# EAGLE schematic SmoothieBrainz - next round 20160618 (EAGLE 7.2.0)
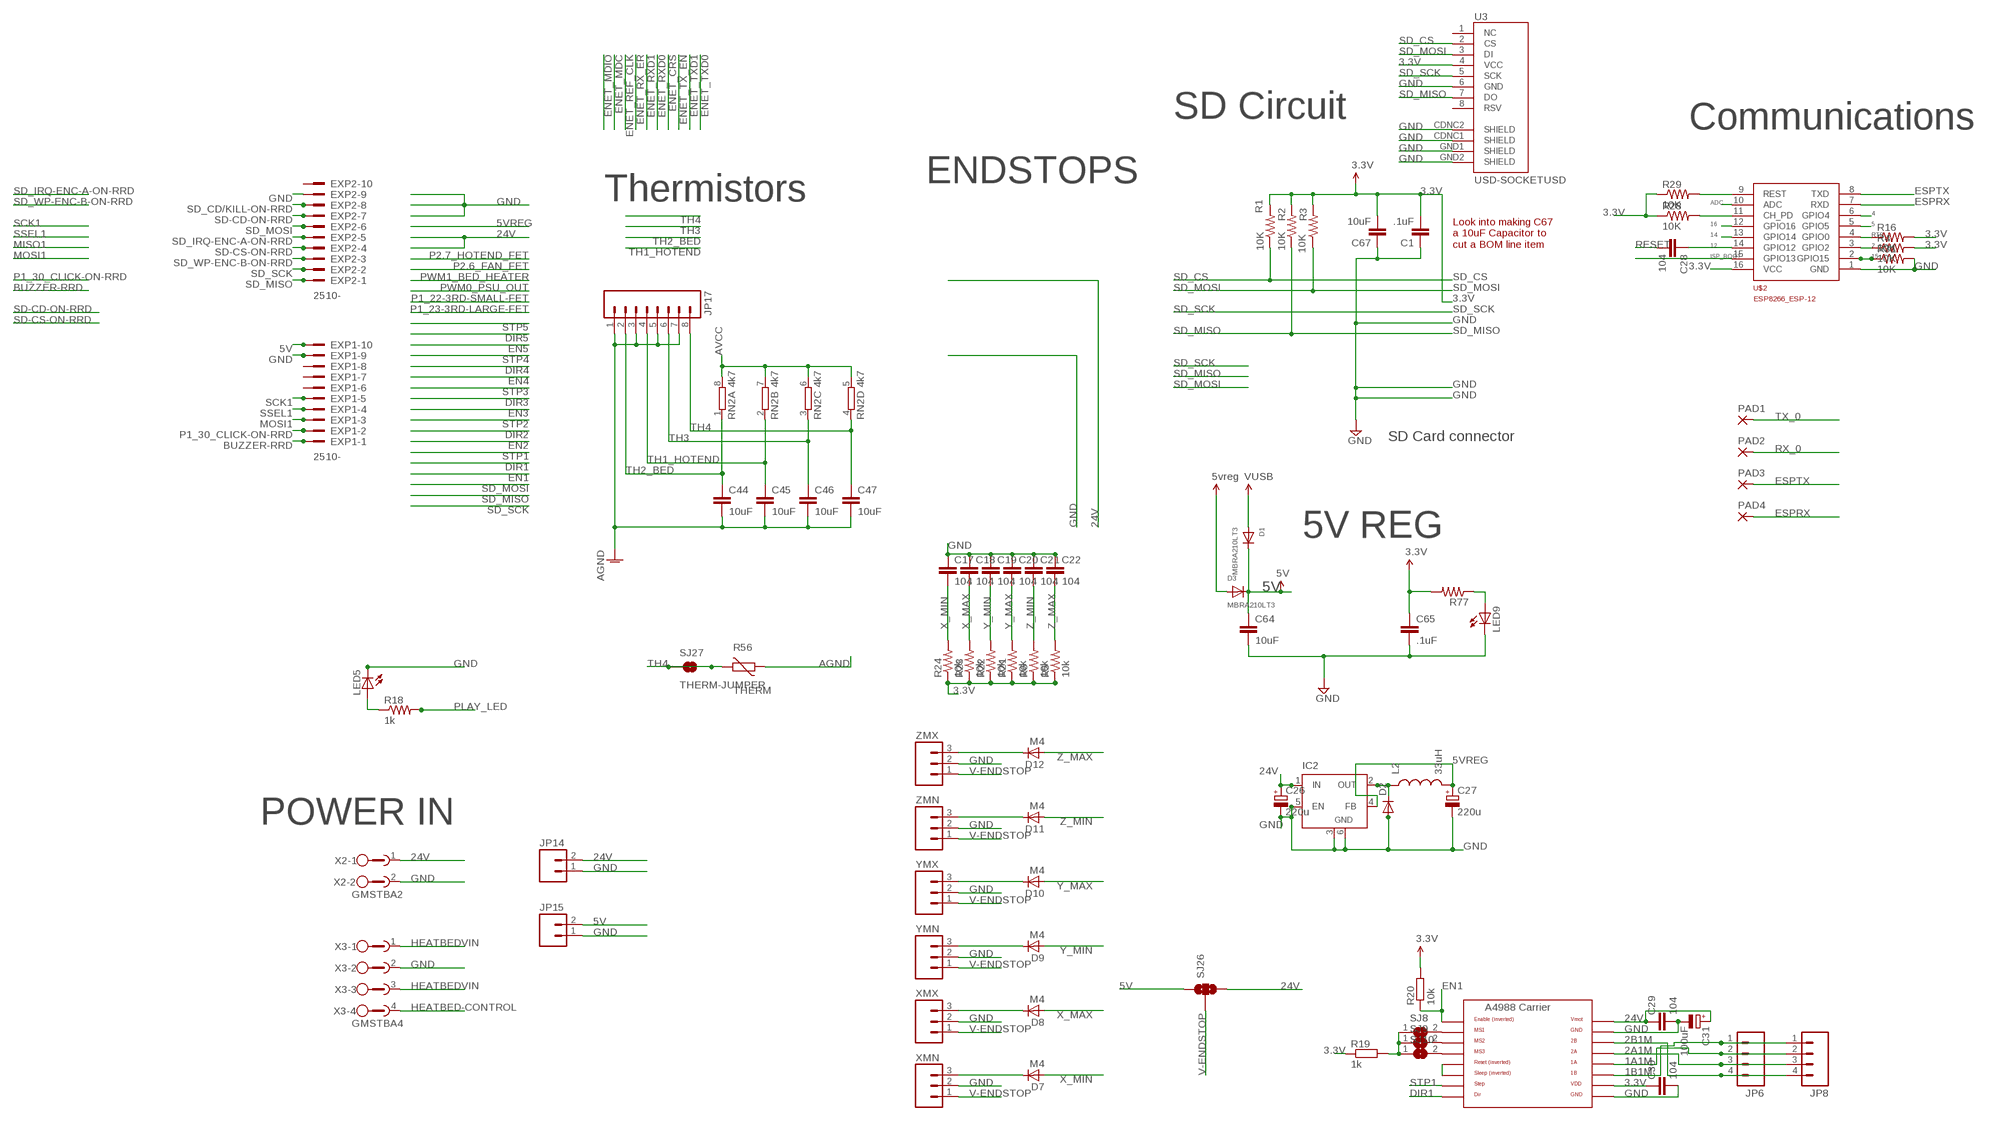
[diagram p0: schematic, sheet 1, part 1 of 3]
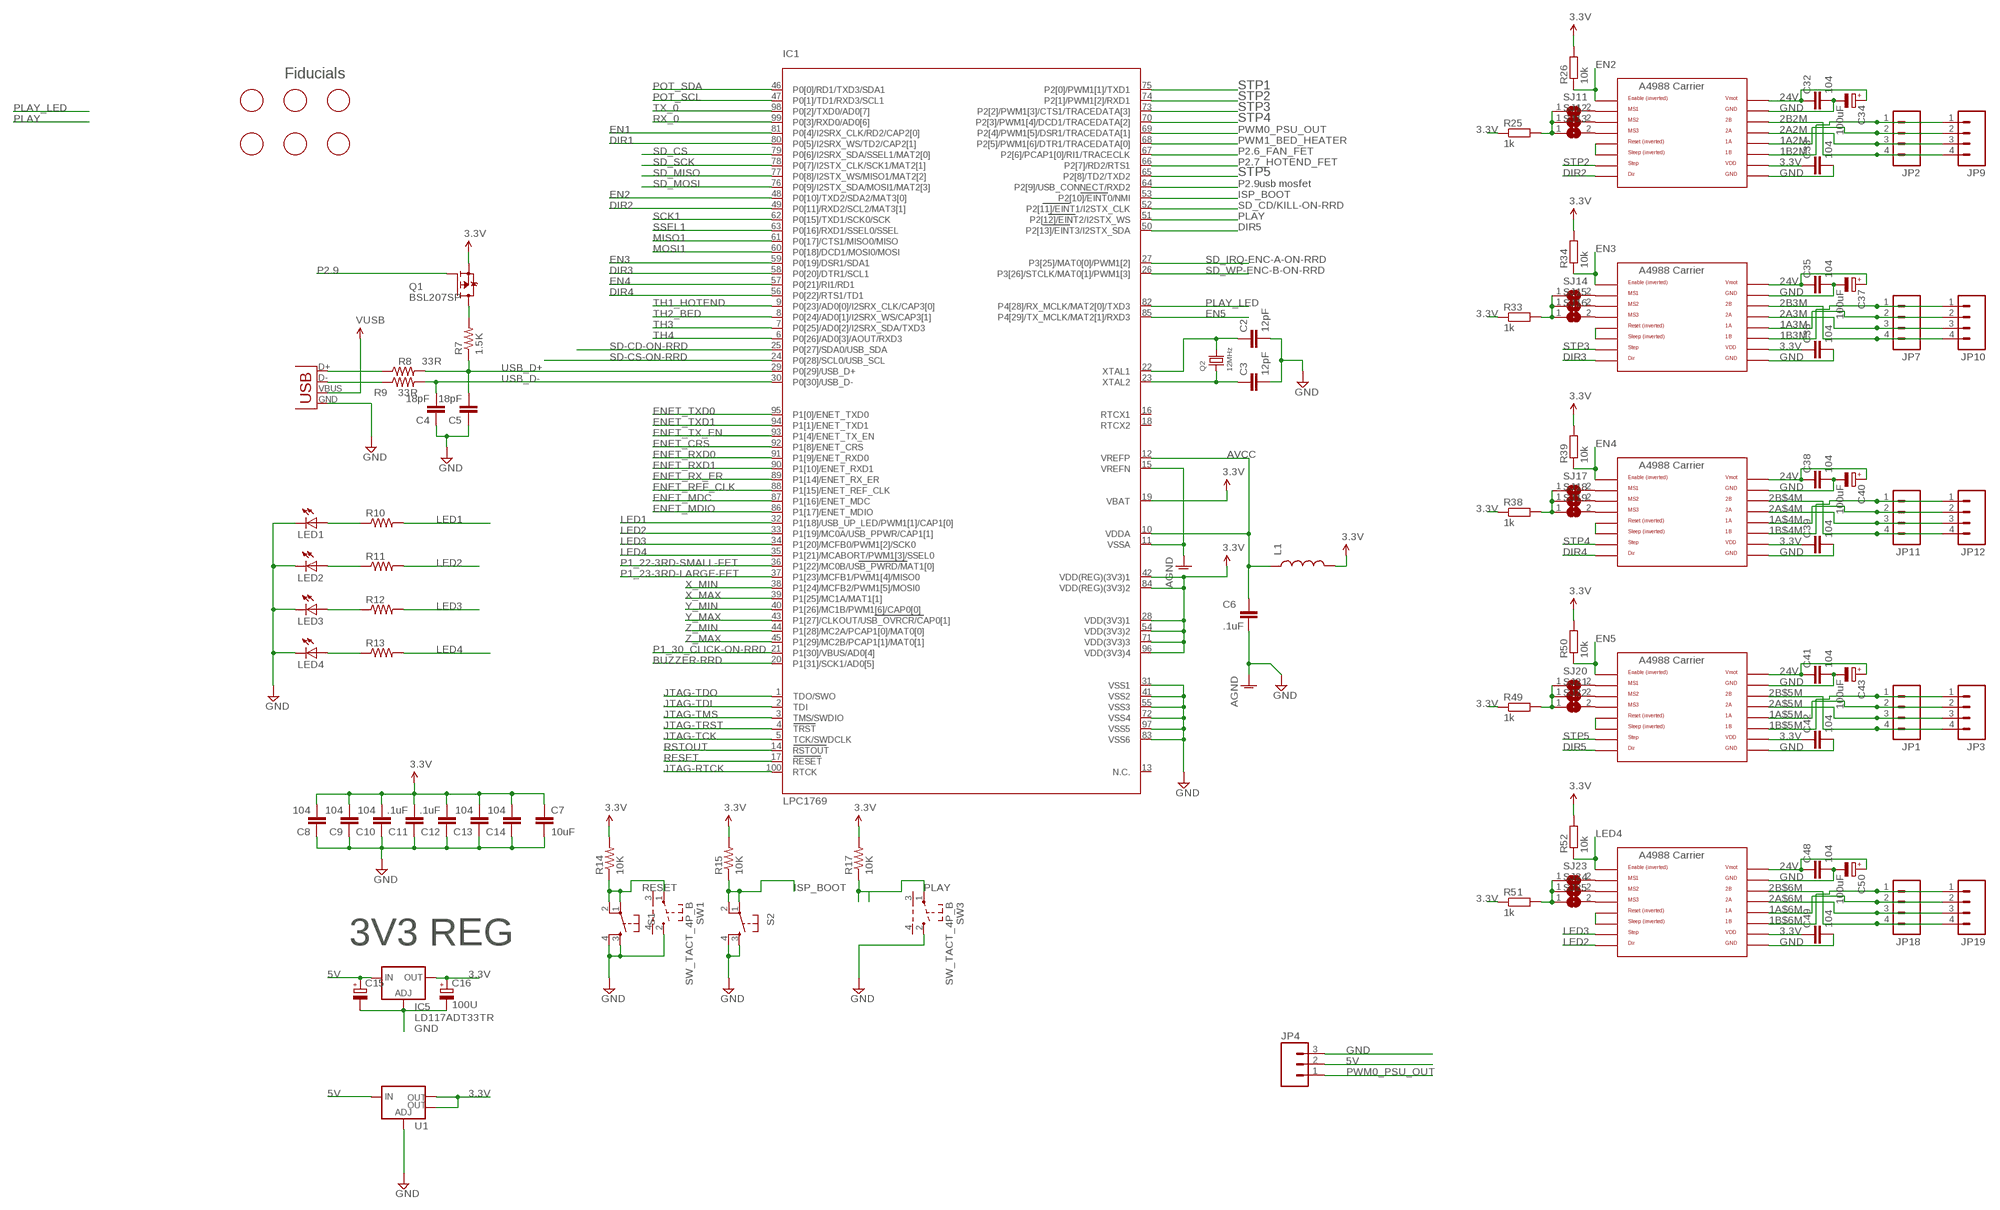
[diagram p1: schematic, sheet 1, part 2 of 3]
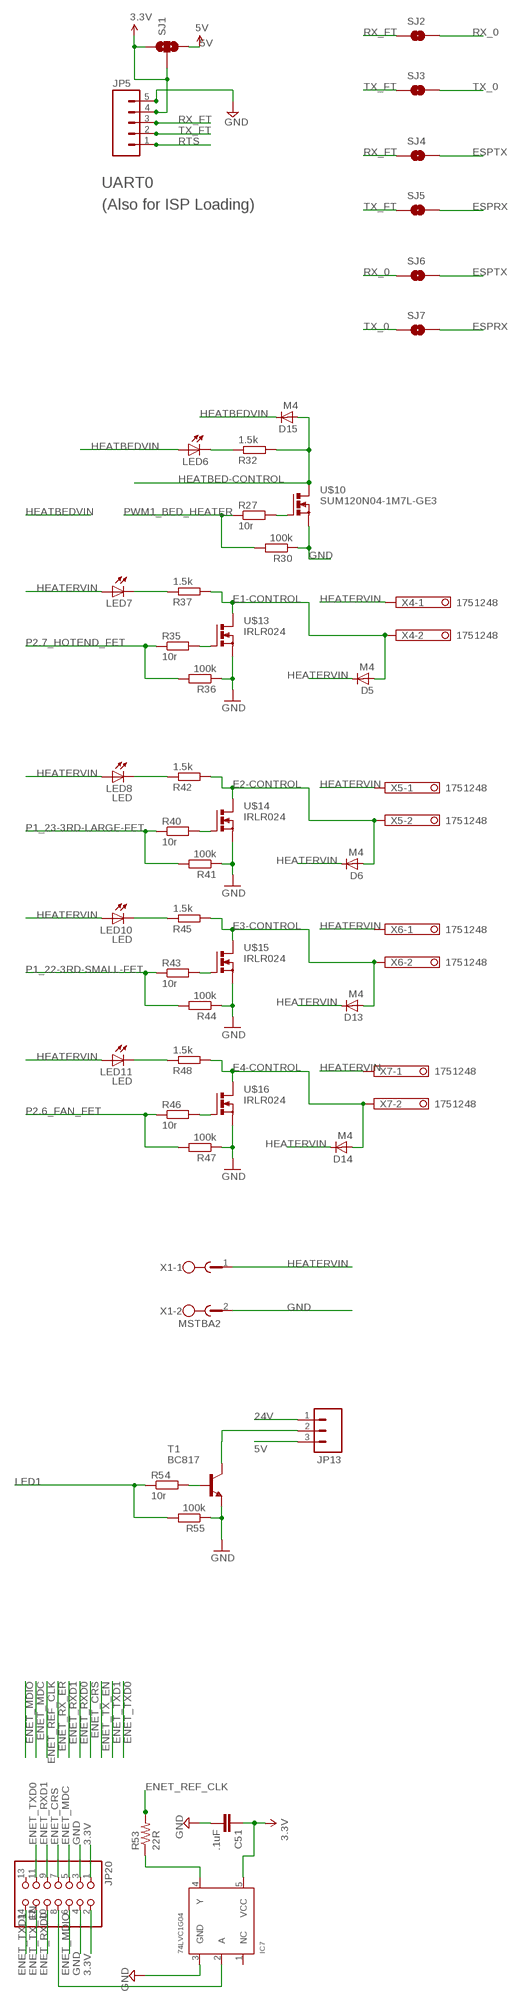
[diagram p2: schematic, sheet 1, part 3 of 3]

## Parts
C1  .1uF  C-EUC0603  [C0603]
C2  12pF  C-EUC0603  [C0603]
C3  12pF  C-EUC0603  [C0603]
C4  18pF  C-EUC0603  [C0603]
C5  18pF  C-EUC0603  [C0603]
C6  .1uF  C-EUC0603  [C0603]
C7  10uF  C-EUC0603  [C0603]
C8  104  C-EUC0603  [C0603]
C9  104  C-EUC0603  [C0603]
C10  104  C-EUC0603  [C0603]
C11  .1uF  C-EUC0603  [C0603]
C12  .1uF  C-EUC0603  [C0603]
C13  104  C-EUC0603  [C0603]
C14  104  C-EUC0603  [C0603]
C15  CPOL-EUE2.5-7  [E2,5-7]
C16  100U  CPOL-EUE2.5-7  [E2,5-7]
C17  104  C-EUC0603  [C0603]
C18  104  C-EUC0603  [C0603]
C19  104  C-EUC0603  [C0603]
C20  104  C-EUC0603  [C0603]
C21  104  C-EUC0603  [C0603]
C22  104  C-EUC0603  [C0603]
C26  220u  CPOL-EUE2.5-7  [E2,5-7]
C27  220u  CPOL-EUE2.5-7  [E2,5-7]
C28  104  C-EUC0603  [C0603]
C29  104  C-EUC0603  [C0603]
C30  104  C-EUC0603  [C0603]
C31  100uF  CPOL-EU153CLV-0605  [153CLV-0605]
C32  104  C-EUC0603  [C0603]
C33  104  C-EUC0603  [C0603]
C34  100uF  CPOL-EU153CLV-0605  [153CLV-0605]
C35  104  C-EUC0603  [C0603]
C36  104  C-EUC0603  [C0603]
C37  100uF  CPOL-EU153CLV-0605  [153CLV-0605]
C38  104  C-EUC0603  [C0603]
C39  104  C-EUC0603  [C0603]
C40  100uF  CPOL-EU153CLV-0605  [153CLV-0605]
C41  104  C-EUC0603  [C0603]
C42  104  C-EUC0603  [C0603]
C43  100uF  CPOL-EU153CLV-0605  [153CLV-0605]
C44  10uF  C-EUC0603  [C0603]
C45  10uF  C-EUC0603  [C0603]
C46  10uF  C-EUC0603  [C0603]
C47  10uF  C-EUC0603  [C0603]
C48  104  C-EUC0603  [C0603]
C49  104  C-EUC0603  [C0603]
C50  100uF  CPOL-EU153CLV-0605  [153CLV-0605]
C51  .1uF  C-EUC0603  [C0603]
C64  10uF  C-EUC0603  [C0603]
C65  .1uF  C-EUC0603  [C0603]
C67  10uF  C-EUC0603  [C0603]
D1  MBRA210LT3  DIODESMA  [SMADIODE]
D2  DIODE-DO-214AC  [DO-214AC]
D3  MBRA210LT3  DIODESMA  [SMADIODE]
D5  M4  D-SOD-87  [SOD87]
D6  M4  D-SOD-87  [SOD87]
D7  M4  D-SOD-87  [SOD87]
D8  M4  D-SOD-87  [SOD87]
D9  M4  D-SOD-87  [SOD87]
D10  M4  D-SOD-87  [SOD87]
D11  M4  D-SOD-87  [SOD87]
D12  M4  D-SOD-87  [SOD87]
D13  M4  D-SOD-87  [SOD87]
D14  M4  D-SOD-87  [SOD87]
D15  M4  D-SOD-87  [SOD87]
EXP1  2510-  [PAK100/2500-10]
EXP2  2510-  [PAK100/2500-10]
IC1  LPC1769  LPC1768  [LQFP100]
IC2  LM2596S  [TO263-5]
IC5  LD117ADT33TR  [DPACK]
IC7  74LVC1G04  [SOT23-5]
JP1  M04POLAR_LOCK  [MOLEX-1X4_LOCK]
JP2  M04POLAR_LOCK  [MOLEX-1X4_LOCK]
JP3  M04LOCK  [1X04_LOCK]
JP4  M03LOCK  [1X03_LOCK]
JP5  M05NO_SILK  [1X05_NO_SILK]
JP6  M04POLAR_LOCK  [MOLEX-1X4_LOCK]
JP7  M04POLAR_LOCK  [MOLEX-1X4_LOCK]
JP8  M04LOCK  [1X04_LOCK]
JP9  M04LOCK  [1X04_LOCK]
JP10  M04LOCK  [1X04_LOCK]
JP11  M04POLAR_LOCK  [MOLEX-1X4_LOCK]
JP12  M04LOCK  [1X04_LOCK]
JP13  M03LOCK  [1X03_LOCK]
JP14  M02LOCK  [1X02_LOCK]
JP15  M02LOCK  [1X02_LOCK]
JP17  M08LOCK  [1X08_LOCK]
JP18  M04POLAR_LOCK  [MOLEX-1X4_LOCK]
JP19  M04LOCK  [1X04_LOCK]
JP20  PINHD-2X7  [2X07]
L1  INDUCTOR0603  [0603]
L2  33uH  INDUCTORPWR  [CDRH125]
LED1  LEDCHIP-LED0805  [CHIP-LED0805]
LED2  LEDCHIP-LED0805  [CHIP-LED0805]
LED3  LEDCHIP-LED0805  [CHIP-LED0805]
LED4  LEDCHIP-LED0805  [CHIP-LED0805]
LED5  LEDCHIP-LED0603  [CHIP-LED0603]
LED6  LEDSML0603  [SML0603]
LED7  LEDSML0603  [SML0603]
LED8  LED  LEDSML0603  [SML0603]
LED9  LEDCHIP-LED0805  [CHIP-LED0805]
LED10  LED  LEDSML0603  [SML0603]
LED11  LED  LEDSML0603  [SML0603]
PAD1  1,6/0,9  [1,6/0,9]
PAD2  1,6/0,9  [1,6/0,9]
PAD3  1,6/0,9  [1,6/0,9]
PAD4  1,6/0,9  [1,6/0,9]
Q1  BSL207SP  [SC74_INFINEON]
Q2  12MHz  CRYSTALTHIN  [CRYSTAL_3.2X2.5]
R1  10K  R-US_R0603  [R0603]
R2  10K  R-US_R0603  [R0603]
R3  10K  R-US_R0603  [R0603]
R4  10K  R-US_R0603  [R0603]
R5  10k  R-US_R0603  [R0603]
R6  10k  R-US_R0603  [R0603]
R7  1.5K  R-US_R0603  [R0603]
R8  33R  R-US_R0603  [R0603]
R9  33R  R-US_R0603  [R0603]
R10  R-US_R0603  [R0603]
R11  R-US_R0603  [R0603]
R12  R-US_R0603  [R0603]
R13  R-US_R0603  [R0603]
R14  10K  R-US_R0603  [R0603]
R15  10K  R-US_R0603  [R0603]
R16  10K  R-US_R0603  [R0603]
R17  10K  R-US_R0603  [R0603]
R18  1k  R-US_R0603  [R0603]
R19  1k  R-EU_R0603  [R0603]
R20  10k  R-EU_R0603  [R0603]
R21  10k  R-US_R0603  [R0603]
R22  10k  R-US_R0603  [R0603]
R23  10k  R-US_R0603  [R0603]
R24  10k  R-US_R0603  [R0603]
R25  1k  R-EU_R0603  [R0603]
R26  10k  R-EU_R0603  [R0603]
R27  10r  R-EU_R0603  [R0603]
R28  10K  R-US_R0603  [R0603]
R29  10K  R-US_R0603  [R0603]
R30  100k  R-EU_R0603  [R0603]
R31  10K  R-US_R0603  [R0603]
R32  1.5k  R-EU_R0603  [R0603]
R33  1k  R-EU_R0603  [R0603]
R34  10k  R-EU_R0603  [R0603]
R35  10r  R-EU_R0603  [R0603]
R36  100k  R-EU_R0603  [R0603]
R37  1.5k  R-EU_R0603  [R0603]
R38  1k  R-EU_R0603  [R0603]
R39  10k  R-EU_R0603  [R0603]
R40  10r  R-EU_R0603  [R0603]
R41  100k  R-EU_R0603  [R0603]
R42  1.5k  R-EU_R0603  [R0603]
R43  10r  R-EU_R0603  [R0603]
R44  100k  R-EU_R0603  [R0603]
R45  1.5k  R-EU_R0603  [R0603]
R46  10r  R-EU_R0603  [R0603]
R47  100k  R-EU_R0603  [R0603]
R48  1.5k  R-EU_R0603  [R0603]
R49  1k  R-EU_R0603  [R0603]
R50  10k  R-EU_R0603  [R0603]
R51  1k  R-EU_R0603  [R0603]
R52  10k  R-EU_R0603  [R0603]
R53  22R  R-US_R0603  [R0603]
R54  10r  R-EU_R0603  [R0603]
R55  100k  R-EU_R0603  [R0603]
R56  THERM  VARISTORCN0603  [CT/CN0603]
R77  R-US_R0603  [R0603]
RN2  4k7  4R-N0603-ARV  [0603-ARV]
S1  TAC_SWITCHSMD  [TACTILE_SWITCH_SMD]
S2  TAC_SWITCHSMD  [TACTILE_SWITCH_SMD]
SJ1  SOLDERJUMPER_2WAYS  [SJ_3]
SJ2  SOLDERJUMPERNC  [SJ_2S]
SJ3  SOLDERJUMPERNC  [SJ_2S]
SJ4  SOLDERJUMPERNC  [SJ_2S]
SJ5  SOLDERJUMPERNC  [SJ_2S]
SJ6  SOLDERJUMPERNC  [SJ_2S]
SJ7  SOLDERJUMPERNC  [SJ_2S]
SJ8  SJ  [SJ]
SJ9  SJ  [SJ]
SJ10  SJ  [SJ]
SJ11  SJ  [SJ]
SJ12  SJ  [SJ]
SJ13  SJ  [SJ]
SJ14  SJ  [SJ]
SJ15  SJ  [SJ]
SJ16  SJ  [SJ]
SJ17  SJ  [SJ]
SJ18  SJ  [SJ]
SJ19  SJ  [SJ]
SJ20  SJ  [SJ]
SJ21  SJ  [SJ]
SJ22  SJ  [SJ]
SJ23  SJ  [SJ]
SJ24  SJ  [SJ]
SJ25  SJ  [SJ]
SJ26  SOLDERJUMPER_2WAYS  [SJ_3]
SJ27  THERM-JUMPER  SOLDERJUMPERTRACE  [SJ_2S-TRACE]
SW1  SW_TACT_4P_B  [SW_TACT_STANDARD_RIGHT_ANGLE]
SW3  SW_TACT_4P_B  [SW_TACT_STANDARD_RIGHT_ANGLE]
T1  BC817  BC817-40-NPN-SOT23-BEC  [SOT23-BEC]
U1  V_REG_LM1117SOT223  [SOT223]
U3  USD-SOCKETUSD  [USD-SOCKET-PP]
U$1  POLOLU_A4983CARRIER  [A4988BREAKOUT]
U$2  ESP8266_ESP-12  [ESP8266-ESP12]
U$5  POLOLU_A4983CARRIER  [A4988BREAKOUT]
U$6  POLOLU_A4983CARRIER  [A4988BREAKOUT]
U$7  POLOLU_A4983CARRIER  [A4988BREAKOUT]
U$8  POLOLU_A4983CARRIER  [A4988BREAKOUT]
U$9  POLOLU_A4983CARRIER  [A4988BREAKOUT]
U$10  SUM120N04-1M7L-GE3  N-POWER-MOSFETD2PAK-MOSFET  [D2PACK]
U$11  FIDUCIAL  [FIDUCIAL_1MM]
U$12  FIDUCIAL  [FIDUCIAL_1MM]
U$13  IRLR024  N-POWER-MOSFETDPAK-MOSFET  [D-PAK_TO252AA]
U$14  IRLR024  N-POWER-MOSFETDPAK-MOSFET  [D-PAK_TO252AA]
U$15  IRLR024  N-POWER-MOSFETDPAK-MOSFET  [D-PAK_TO252AA]
U$16  IRLR024  N-POWER-MOSFETDPAK-MOSFET  [D-PAK_TO252AA]
U$17  FIDUCIAL  [FIDUCIAL_1MM]
U$18  FIDUCIAL  [FIDUCIAL_1MM]
U$19  FIDUCIAL  [FIDUCIAL_1MM]
U$20  FIDUCIAL  [FIDUCIAL_1MM]
X1  MSTBA2  [MSTBA2]
X2  GMSTBA2  [GMSTBA2]
X3  GMSTBA4  [GMSTBA4]
X4  1751248  [1751248]
X5  1751248  [1751248]
X6  1751248  [1751248]
X7  1751248  [1751248]
X14  USBPTH  [USB-B-PTH]
XMN  M03POLAR_LOCK  [MOLEX-1X3_LOCK]
XMX  M03POLAR_LOCK  [MOLEX-1X3_LOCK]
YMN  M03POLAR_LOCK  [MOLEX-1X3_LOCK]
YMX  M03POLAR_LOCK  [MOLEX-1X3_LOCK]
ZMN  M03POLAR_LOCK  [MOLEX-1X3_LOCK]
ZMX  M03POLAR_LOCK  [MOLEX-1X3_LOCK]

## Nets
1A1M: JP6.2 JP8.2 U$1.1A
1A2M: JP2.2 JP9.2 U$5.1A
1A3M: JP7.2 JP10.2 U$6.1A
1A$4M: JP11.2 JP12.2 U$7.1A
1A$5M: JP1.2 JP3.2 U$8.1A
1A$6M: JP18.2 JP19.2 U$9.1A
1B1M: JP6.1 JP8.1 U$1.1B
1B2M: JP2.1 JP9.1 U$5.1B
1B3M: JP7.1 JP10.1 U$6.1B
1B$4M: JP11.1 JP12.1 U$7.1B
1B$5M: JP1.1 JP3.1 U$8.1B
1B$6M: JP18.1 JP19.1 U$9.1B
2: R4.1 U$2.3(GPIO2)
2A1M: JP6.3 JP8.3 U$1.2A
2A2M: JP2.3 JP9.3 U$5.2A
2A3M: JP7.3 JP10.3 U$6.2A
2A$4M: JP11.3 JP12.3 U$7.2A
2A$5M: JP1.3 JP3.3 U$8.2A
2A$6M: JP18.3 JP19.3 U$9.2A
2B1M: JP6.4 JP8.4 U$1.2B
2B2M: JP2.4 JP9.4 U$5.2B
2B3M: JP7.4 JP10.4 U$6.2B
2B$4M: JP11.4 JP12.4 U$7.2B
2B$5M: JP1.4 JP3.4 U$8.2B
2B$6M: JP18.4 JP19.4 U$9.2B
3.3V: C1.2 C7.1 C8.2 C9.2 C10.2 C11.2 C12.2 C13.2 C14.2 C16.+ C30.1 C33.1 C36.1 C39.1 C42.1 C49.1 C51.1 C65.1 C67.2 IC1.19(VBAT) IC1.28(VDD(3V3)1) IC1.42(VDD(REG)(3V3)1) IC1.54(VDD(3V3)2) IC1.71(VDD(3V3)3) IC1.84(VDD(REG)(3V3)2) IC1.96(VDD(3V3)4) IC5.4(OUT) IC7.5(VCC) JP5.4 JP20.1 JP20.2 L1.2 Q1.4(S) R1.2 R2.2 R3.2 R4.2 R5.1 R6.1 R14.2 R15.2 R16.2 R17.2 R19.1 R20.2 R21.1 R22.1 R23.1 R24.1 R25.1 R26.2 R28.1 R29.1 R33.1 R34.2 R38.1 R39.2 R49.1 R50.2 R51.1 R52.2 R77.2 SJ1.1 SJ1.2 U1.2(OUT) U1.4(OUT) U3.4(VCC) U$1.VDD U$2.16(VCC) U$5.VDD U$6.VDD U$7.VDD U$8.VDD U$9.VDD
4: U$2.6(GPIO4)
5: U$2.5(GPIO5)
5V: C15.+ C64.1 D1.C D3.C EXP1.10 IC5.3(IN) JP4.2 JP13.3 JP15.2 SJ1.3 SJ26.1 U1.3(IN)
5VREG: C27.+ D3.A IC2.4(FB) L2.2 ; supply symbol labelled 5vreg
12: C28.1 U$2.14(GPIO12)
14: U$2.13(GPIO14)
15: R31.1 U$2.2(GPIO15)
16: U$2.12(GPIO16)
24V: C26.+ C29.1 C31.+ C32.1 C34.+ C35.1 C37.+ C38.1 C40.+ C41.1 C43.+ C48.1 C50.+ IC2.1(IN) JP13.1 JP14.2 SJ26.3 U$1.VMOT U$5.VMOT U$6.VMOT U$7.VMOT U$8.VMOT U$9.VMOT X2.1
ADC: U$2.10(ADC)
AGND: C6.2 C44.2 C45.2 C46.2 C47.2 IC1.11(VSSA) IC1.15(VREFN) JP17.1 JP17.3 JP17.5 JP17.7 R56.1 ; supply symbol labelled GND
AVCC: C6.1 IC1.10(VDDA) IC1.12(VREFP) L1.1 RN2.5 RN2.6 RN2.7 RN2.8
BUZZER-RRD: EXP1.1 IC1.20(P1[31]/SCK1/AD0[5])
DIR1: IC1.80(P0[5]/I2SRX_WS/TD2/CAP2[1]) U$1.DIR
DIR2: IC1.49(P0[11]/RXD2/SCL2/MAT3[1]) U$5.DIR
DIR3: IC1.58(P0[20]/DTR1/SCL1) U$6.DIR
DIR4: IC1.56(P0[22]/RTS1/TD1) U$7.DIR
DIR5: IC1.50(P2[13]/EINT3/I2STX_SDA) U$8.DIR
E1-CONTROL [3.3-Amp Class]: D5.2(A) R37.2 U$13.4(D) X4.2
E2-CONTROL [3.3-Amp Class]: D6.2(A) R42.2 U$14.4(D) X5.2
E3-CONTROL [3.3-Amp Class]: D13.2(A) R45.2 U$15.4(D) X6.2
E4-CONTROL [3.3-Amp Class]: D14.2(A) R48.2 U$16.4(D) X7.2
EN1: IC1.81(P0[4]/I2SRX_CLK/RD2/CAP2[0]) R20.1 U$1.EN
EN2: IC1.48(P0[10]/TXD2/SDA2/MAT3[0]) R26.1 U$5.EN
EN3: IC1.59(P0[19]/DSR1/SDA1) R34.1 U$6.EN
EN4: IC1.57(P0[21]/RI1/RD1) R39.1 U$7.EN
EN5: IC1.85(P4[29]/TX_MCLK/MAT2[1]/RXD3) R50.1 U$8.EN
ENET_CRS: IC1.92(P1[8]/ENET_CRS) JP20.7
ENET_MDC: IC1.87(P1[16]/ENET_MDC) JP20.5
ENET_MDIO: IC1.86(P1[17]/ENET_MDIO) JP20.6
ENET_REF_CLK: IC1.88(P1[15]/ENET_REF_CLK) R53.2
ENET_RX_ER: IC1.89(P1[14]/ENET_RX_ER)
ENET_RXD0: IC1.91(P1[9]/ENET_RXD0) JP20.10
ENET_RXD1: IC1.90(P1[10]/ENET_RXD1) JP20.9
ENET_TX_EN: IC1.93(P1[4]/ENET_TX_EN) JP20.12
ENET_TXD0: IC1.95(P1[0]/ENET_TXD0) JP20.11
ENET_TXD1: IC1.94(P1[1]/ENET_TXD1) JP20.14
ESPRX: PAD4.1(P) SJ5.2 SJ7.2 U$2.7(RXD)
ESPTX: PAD3.1(P) SJ4.2 SJ6.2 U$2.8(TXD)
GND: C1.1 C2.2 C3.2 C4.1 C5.1 C7.2 C8.1 C9.1 C10.1 C11.1 C12.1 C13.1 C14.1 C15.- C16.- C17.1 C18.1 C19.1 C20.1 C21.1 C22.1 C26.- C27.- C29.2 C30.2 C31.- C32.2 C33.2 C34.- C35.2 C36.2 C37.- C38.2 C39.2 C40.- C41.2 C42.2 C43.- C48.2 C49.2 C50.- C51.2 C64.2 C65.2 C67.1 D2.2(A) EXP1.9 EXP2.9 IC1.31(VSS1) IC1.41(VSS2) IC1.55(VSS3) IC1.72(VSS4) IC1.83(VSS6) IC1.97(VSS5) IC2.3(GND) IC2.5(EN) IC2.6(GND) IC5.1(ADJ) IC7.3(GND) JP4.3 JP5.5 JP14.1 JP15.1 JP20.3 JP20.4 LED1.C LED2.C LED3.C LED4.C LED5.C LED9.C R30.1 R31.2 R36.1 R41.1 R44.1 R47.1 R55.1 S1.3 S1.4 S2.3 S2.4 SW1.2 SW3.2 T1.E U1.1(ADJ) U3.6(GND) U3.CDNC1(SHIELD) U3.CDNC2(SHIELD) U3.GND1(SHIELD) U3.GND2(SHIELD) U$1.GND U$1.GND@0(GND) U$2.1(GND) U$5.GND U$5.GND@0(GND) U$6.GND U$6.GND@0(GND) U$7.GND U$7.GND@0(GND) U$8.GND U$8.GND@0(GND) U$9.GND U$9.GND@0(GND) U$10.3(S) U$13.3(S) U$14.3(S) U$15.3(S) U$16.3(S) X1.2 X2.2 X3.2 X14.GND XMN.2 XMX.2 YMN.2 YMX.2 ZMN.2 ZMX.2
HEATBED-CONTROL: D15.2(A) R32.2 U$10.2(D) X3.4
HEATBEDVIN: D15.1(C) LED6.A X3.1 X3.3
HEATERVIN: D5.1(C) D6.1(C) D13.1(C) D14.1(C) LED7.A LED8.A LED10.A LED11.A X1.1 X4.1 X5.1 X6.1 X7.1
ISP_BOOT: IC1.53(P2[10]/EINT0/NMI) R15.1 S2.1 S2.2 U$2.15(GPIO13)
JTAG-RTCK: IC1.100(RTCK)
JTAG-TCK: IC1.5(TCK/SWDCLK)
JTAG-TDI: IC1.2(TDI)
JTAG-TDO: IC1.1(TDO/SWO)
JTAG-TMS: IC1.3(TMS/SWDIO)
JTAG-TRST: IC1.4(TRST)
LED1: IC1.32(P1[18]/USB_UP_LED/PWM1[1]/CAP1[0]) R10.2 R54.1 R55.2
LED2: IC1.33(P1[19]/MC0A/USB_PPWR/CAP1[1]) R11.2 U$9.DIR
LED3: IC1.34(P1[20]/MCFB0/PWM1[2]/SCK0) R12.2 U$9.STEP
LED4: IC1.35(P1[21]/MCABORT/PWM1[3]/SSEL0) R13.2 R52.1 U$9.EN
MISO1: IC1.61(P0[17]/CTS1/MISO0/MISO)
MOSI1: EXP1.3 IC1.60(P0[18]/DCD1/MOSI0/MOSI)
N$1: C2.1 IC1.22(XTAL1) Q2.2
N$2: C3.1 IC1.23(XTAL2) Q2.1
N$3: LED5.A R18.1
N$4: D11.1(C) ZMN.3
N$5: D10.1(C) YMX.3
N$6: SJ8.2 U$1.MS1
N$7: D9.1(C) YMN.3
N$8: SJ9.2 U$1.MS2
N$9: D2.1(C) IC2.2(OUT) L2.1
N$10: SJ10.2 U$1.MS3
N$11: D8.1(C) XMX.3
N$12: U$5.RST U$5.SLP(SLEEP)
N$13: D7.1(C) XMN.3
N$14: R25.2 SJ11.1 SJ12.1 SJ13.1
N$15: SJ11.2 U$5.MS1
N$16: D12.1(C) ZMX.3
N$17: SJ12.2 U$5.MS2
N$18: R28.2 U$2.11(CH_PD)
N$19: SJ13.2 U$5.MS3
N$20: R27.2 U$10.1(G)
N$21: LED6.C R32.1
N$22: U$6.RST U$6.SLP(SLEEP)
N$24: R33.2 SJ14.1 SJ15.1 SJ16.1
N$25: SJ14.2 U$6.MS1
N$26: SJ15.2 U$6.MS2
N$27: SJ16.2 U$6.MS3
N$28: R35.2 U$13.1(G)
N$29: R19.2 SJ8.1 SJ9.1 SJ10.1
N$30: LED7.C R37.1
N$31: U$7.RST U$7.SLP(SLEEP)
N$32: R38.2 SJ17.1 SJ18.1 SJ19.1
N$33: SJ17.2 U$7.MS1
N$34: SJ18.2 U$7.MS2
N$35: U$1.RST U$1.SLP(SLEEP)
N$36: SJ19.2 U$7.MS3
N$37: R40.2 U$14.1(G)
N$38: LED8.C R42.1
N$39: R43.2 U$15.1(G)
N$40: LED10.C R45.1
N$41: R46.2 U$16.1(G)
N$42: LED11.C R48.1
N$43: U$8.RST U$8.SLP(SLEEP)
N$44: R49.2 SJ20.1 SJ21.1 SJ22.1
N$45: SJ20.2 U$8.MS1
N$46: SJ21.2 U$8.MS2
N$47: SJ22.2 U$8.MS3
N$48: U$9.RST U$9.SLP(SLEEP)
N$49: R51.2 SJ23.1 SJ24.1 SJ25.1
N$50: SJ23.2 U$9.MS1
N$51: Q1.1(D) Q1.2(D) Q1.5(D) Q1.6(D) R7.2
N$53: SJ24.2 U$9.MS2
N$54: SJ25.2 U$9.MS3
N$55: R54.2 T1.B
N$56: JP13.2 T1.C
N$61: R8.1 X14.D+
N$62: R9.1 X14.D-
N$77: IC7.2(A) JP20.8
N$78: IC7.4(Y) R53.1
N$80: LED9.A R77.1
N$84: LED4.A R13.1
N$85: LED3.A R12.1
N$86: LED2.A R11.1
N$87: LED1.A R10.1
P1_22-3RD-SMALL-FET: IC1.36(P1[22]/MC0B/USB_PWRD/MAT1[0]) R43.1 R44.2
P1_23-3RD-LARGE-FET: IC1.37(P1[23]/MCFB1/PWM1[4]/MISO0) R40.1 R41.2
P1_30_CLICK-ON-RRD: EXP1.2 IC1.21(P1[30]/VBUS/AD0[4])
P2.6_FAN_FET: IC1.67(P2[6]/PCAP1[0]/RI1/TRACECLK) R46.1 R47.2
P2.7_HOTEND_FET: IC1.66(P2[7]/RD2/RTS1) R35.1 R36.2
P2.9: IC1.64(P2[9]/USB_CONNECT/RXD2) Q1.3(G)
PLAY: IC1.51(P2[12]/EINT2/I2STX_WS) R17.1 SW3.1
PLAY_LED: IC1.82(P4[28]/RX_MCLK/MAT2[0]/TXD3) R18.2
POT_SCL: IC1.47(P0[1]/TD1/RXD3/SCL1)
POT_SDA: IC1.46(P0[0]/RD1/TXD3/SDA1)
PWM0_PSU_OUT: IC1.69(P2[4]/PWM1[5]/DSR1/TRACEDATA[1]) JP4.1
PWM1_BED_HEATER: IC1.68(P2[5]/PWM1[6]/DTR1/TRACEDATA[0]) R27.1 R30.2
RESET: C28.2 IC1.17(RESET) R14.1 S1.1 S1.2 SW1.1
RESET1: R29.2 U$2.9(REST)
RSTOUT: IC1.14(RSTOUT)
RTS: JP5.1 R16.1 U$2.4(GPIO0)
RX_0: IC1.99(P0[3]/RXD0/AD0[6]) PAD2.1(P) SJ2.2 SJ6.1
RX_FT: JP5.3 SJ2.1 SJ4.1
SCK1: EXP1.5 IC1.62(P0[15]/TXD1/SCK0/SCK)
SD-CD-ON-RRD: EXP2.7 IC1.25(P0[27]/SDA0/USB_SDA)
SD-CS-ON-RRD: EXP2.4 IC1.24(P0[28]/SCL0/USB_SCL)
SD_CD/KILL-ON-RRD: EXP2.8 IC1.52(P2[11]/EINT1/I2STX_CLK)
SD_CS: IC1.79(P0[6]/I2SRX_SDA/SSEL1/MAT2[0]) R1.1 U3.2(CS)
SD_IRQ-ENC-A-ON-RRD: EXP2.5 IC1.27(P3[25]/MAT0[0]/PWM1[2])
SD_MISO: EXP2.1 IC1.77(P0[8]/I2STX_WS/MISO1/MAT2[2]) R2.1 U3.7(DO)
SD_MOSI: EXP2.6 IC1.76(P0[9]/I2STX_SDA/MOSI1/MAT2[3]) R3.1 U3.3(DI)
SD_SCK: EXP2.2 IC1.78(P0[7]/I2STX_CLK/SCK1/MAT2[1]) U3.5(SCK)
SD_WP-ENC-B-ON-RRD: EXP2.3 IC1.26(P3[26]/STCLK/MAT0[1]/PWM1[3])
SSEL1: EXP1.4 IC1.63(P0[16]/RXD1/SSEL0/SSEL)
STP1: IC1.75(P2[0]/PWM1[1]/TXD1) U$1.STEP
STP2: IC1.74(P2[1]/PWM1[2]/RXD1) U$5.STEP
STP3: IC1.73(P2[2]/PWM1[3]/CTS1/TRACEDATA[3]) U$6.STEP
STP4: IC1.70(P2[3]/PWM1[4]/DCD1/TRACEDATA[2]) U$7.STEP
STP5: IC1.65(P2[8]/TD2/TXD2) U$8.STEP
TH1_HOTEND: C45.1 IC1.9(P0[23]/AD0[0]/I2SRX_CLK/CAP3[0]) JP17.4 RN2.2
TH2_BED: C44.1 IC1.8(P0[24]/AD0[1]/I2SRX_WS/CAP3[1]) JP17.2 RN2.1
TH3: C46.1 IC1.7(P0[25]/AD0[2]/I2SRX_SDA/TXD3) JP17.6 RN2.3
TH4: C47.1 IC1.6(P0[26]/AD0[3]/AOUT/RXD3) JP17.8 R56.2 RN2.4 SJ27.1 SJ27.2
TX_0: IC1.98(P0[2]/TXD0/AD0[7]) PAD1.1(P) SJ3.2 SJ7.1
TX_FT: JP5.2 SJ3.1 SJ5.1
USB_D+: C5.2 IC1.29(P0[29]/USB_D+) R7.1 R8.2
USB_D-: C4.2 IC1.30(P0[30]/USB_D-) R9.2
V-ENDSTOP: SJ26.2 XMN.1 XMX.1 YMN.1 YMX.1 ZMN.1 ZMX.1
VUSB: D1.A X14.VBUS
X_MAX: C18.2 D8.2(A) IC1.39(P1[25]/MC1A/MAT1[1]) R23.2
X_MIN: C17.2 D7.2(A) IC1.38(P1[24]/MCFB2/PWM1[5]/MOSI0) R24.2
Y_MAX: C20.2 D10.2(A) IC1.43(P1[27]/CLKOUT/USB_OVRCR/CAP0[1]) R21.2
Y_MIN: C19.2 D9.2(A) IC1.40(P1[26]/MC1B/PWM1[6]/CAP0[0]) R22.2
Z_MAX: C22.2 D12.2(A) IC1.45(P1[29]/MC2B/PCAP1[1]/MAT0[1]) R5.2
Z_MIN: C21.2 D11.2(A) IC1.44(P1[28]/MC2A/PCAP1[0]/MAT0[0]) R6.2
Unconnected: EXP1.6 EXP1.7 EXP1.8 EXP2.10 IC1.13(N.C.) IC1.16(RTCX1) IC1.18(RTCX2) IC7.1(NC) JP20.13 SW1.3 SW1.4 SW3.3 SW3.4 U3.1(NC) U3.8(RSV)

## Notes on the sheet
- SD Circuit | Communications
- ENDSTOPS
- Thermistors
- Look into making C67 
  a 10uF Capacitor to 
  cut a BOM line item
- UART0
- (Also for ISP Loading)
- SD Card connector
- 5V REG
- POWER IN
- Fiducials
- usb mosfet
- 3V3 REG

## Library data of the parts
C1 C7 C17-C22 C28-C30 C32 C33 C35 C36 C38 C39 C41 C42 C44-C49 C51 C64 C65 C67 = resistor:C-EU: CAPACITOR, European symbol
C2-C6 C8-C14 = rcl:C-EU: CAPACITOR, European symbol
C15 C16 C26 C27 = rcl:CPOL-EU: POLARIZED CAPACITOR, European symbol
C31 C34 C37 C40 C43 C50 = resistor:CPOL-EU: POLARIZED CAPACITOR, European symbol
D1 D3 = microbuilder:DIODE: Diode SMADIODE - SMA Surface Mount Package 20V 1A Schottky Diode Digikey (500mV @ 1A, 500uA Vr @ 20V): 641-1014-6-ND 10V 2A Schottky Diode Digikey (350mV @ 2A, 700uA Vr @ 10V): MBRA210LT3 SOD-123 30V 200mA (800mV Vf, 2uA Vr @ 25V) Schottky Diode (very fast switching for boost, etc.) - Digikey: BAT54T1GOSTR-ND 30V 500mA (430mV Vf, 130uA Vr @ 30V) Schottky Diode - Digikey: B0530W-FDICT-ND MBR120 1A 20V (0.34Vf) Schottky Diode - Digikey: MBR120VLSFT1GOSCT-ND SOD-323 10V 570mA (380mV Vf, 3ns) Schottky Diode - Digikey: ZLLS410CT-ND 1N4148WS - 75V 150mA (1V Vf @ 10mA, 4ns) Simple Diode - Digikey: 1N4148WSFSCT-ND, Mouser: 512-1N4148WS SOD-523 BAT54 30V 200mA Schottky (0.8 Vf @ 100mA, 5ns) - Digikey: BAT54XV2CT-ND 30V 30mA Schottky Diode (RB751S-40TE61) - Digikey: RB751S-40TE61CT-ND SOT23-R/W - SOT23 Package (R = Solder Paste/Reflow Ovens, W = Hand-Soldering) BAT54Film 40V 300mA - Digikey: 497-7162-1-ND DO-1N4148 Through Hole Small Current Diode (any model)
D2 = dp_devices:DIODE: Various Diode Packages
D5-D15 = semicon-smd-ipc:D-: DIODE unfilled
EXP1 EXP2 = con-3m:2510-: 3M (TM) Pak 100 4-Wall Header Source: 3M; MF: 3M; MPN: 2510-6002UB; OC_FARNELL: 9838244; OC_NEWARK: 46F4725
IC1 = microbuilder:LPC1768: LPC1768 100 MHz 32-bit ARM Cortex-M3 based microcontroller featuring a high level of integration and low power consumption. 512 kB Flash, 64 kB SRAM, USB Device/Host/OTG, Ethernet, CAN, I2S, 10-bit DAC Digikey: 568-4796-ND
IC2 = linear:LM2596S: STEP-DOWN VOLTAGE REGULATOR
IC5 = v-reg:LD117A?*: Low drop fixed and adjustable positive voltage regulators 1 A Source: http://www.st.com/stonline/products/literature/ds/7194/ld1117axx.pdf
IC7 = microbuilder:74LVC1G04: 74LVC1G04 - Single Inverter Gate SOT23-5 SN74LVC1G04DBVR - Digikey: 296-11599-1-ND
JP1-JP3 JP6-JP12 JP18 JP19 = SparkFun-Connectors:M04: Header 4 Standard 4-pin 0.1" header. Use with straight break away headers (SKU : PRT-00116), right angle break away headers (PRT-00553), swiss pins (PRT-00743), machine pins (PRT-00117), and female headers (PRT-00115). Molex polarized connector foot print use with SKU : PRT-08231 with associated crimp pins and housings. 1MM SMD Version SKU: PRT-10208
JP4 JP13 XMN XMX YMN YMX ZMN ZMX = SparkFun-Connectors:M03: Header 3 Standard 3-pin 0.1" header. Use with straight break away headers (SKU : PRT-00116), right angle break away headers (PRT-00553), swiss pins (PRT-00743), machine pins (PRT-00117), and female headers (PRT-00115). Molex polarized connector foot print use with SKU : PRT-08232 with associated crimp pins and housings.
JP5 = SparkFun-Connectors:M05: Header 5 Standard 5-pin 0.1" header. Use with straight break away headers (SKU : PRT-00116), right angle break away headers (PRT-00553), swiss pins (PRT-00743), machine pins (PRT-00117), and female headers (PRT-00115). Molex polarized connector foot print use with SKU : PRT-08230 with associated crimp pins and housings.
JP14 JP15 = SparkFun-Connectors:M02: Standard 2-pin 0.1" header. Use with - straight break away headers ( PRT-00116) - right angle break away headers (PRT-00553) - swiss pins (PRT-00743) - machine pins (PRT-00117) - female headers (PRT-00115) Molex polarized connector foot print use with: PRT-08233 with associated crimp pins and housings. 2.54_SCREWTERM for use with PRT-10571. 3.5mm Screw Terminal footprints for PRT-08084 5mm Screw Terminal footprints for use with PRT-08432
JP17 = SparkFun-Connectors:M08: Header 8 Standard 8-pin 0.1" header. Use with straight break away headers (SKU : PRT-00116), right angle break away headers (PRT-00553), swiss pins (PRT-00743), machine pins (PRT-00117), and female headers (PRT-00115).
JP20 = pinhead:PINHD-2X7: PIN HEADER
L1 = SparkFun:INDUCTOR: Inductors
L2 = SparkFun-Passives:INDUCTOR: Inductors
LED1-LED11 = led:LED: LED OSRAM: - CHIPLED LG R971, LG N971, LY N971, LG Q971, LY Q971, LO R971, LY R971 LH N974, LH R974 LS Q976, LO Q976, LY Q976 LO Q996 - Hyper CHIPLED LW Q18S LB Q993, LB Q99A, LB R99A - SideLED LS A670, LO A670, LY A670, LG A670, LP A670 LB A673, LV A673, LT A673, LW A673 LH A674 LY A675 LS A676, LA A676, LO A676, LY A676, LW A676 LS A679, LY A679, LG A679 - Hyper Micro SIDELED® LS Y876, LA Y876, LO Y876, LY Y876 LT Y87S - SmartLED LW L88C, LW L88S LB L89C, LB L89S, LG L890 LS L89K, LO L89K, LY L89K LS L896, LA L896, LO L896, LY L896 - TOPLED LS T670, LO T670, LY T670, LG T670, LP T670 LSG T670, LSP T670, LSY T670, LOP T670, LYG T670 LG T671, LOG T671, LSG T671 LB T673, LV T673, LT T673, LW T673 LH T674 LS T676, LA T676, LO T676, LY T676, LB T676, LH T676, LSB T676, LW T676 LB T67C, LV T67C, LT T67C, LS T67K, LO T67K, LY T67K, LW E67C LS E67B, LA E67B, LO E67B, LY E67B, LB E67C, LV E67C, LT E67C LW T67C LS T679, LY T679, LG T679 LS T770, LO T770, LY T770, LG T770, LP T770 LB T773, LV T773, LT T773, LW T773 LH T774 LS E675, LA E675, LY E675, LS T675 LS T776, LA T776, LO T776, LY T776, LB T776 LHGB T686 LT T68C, LB T68C - Hyper Mini TOPLED® LB M676 - Mini TOPLED Santana® LG M470 LS M47K, LO M47K, LY M47K Source: http://www.osram.convergy.de LUXEON: - LUMILED® LXK2-PW12-R00, LXK2-PW12-S00, LXK2-PW14-U00, LXK2-PW14-V00 LXK2-PM12-R00, LXK2-PM12-S00, LXK2-PM14-U00 LXK2-PE12-Q00, LXK2-PE12-R00, LXK2-PE12-S00, LXK2-PE14-T00, LXK2-PE14-U00 LXK2-PB12-K00, LXK2-PB12-L00, LXK2-PB12-M00, LXK2-PB14-N00, LXK2-PB14-P00, LXK2-PB14-Q00 LXK2-PR12-L00, LXK2-PR12-M00, LXK2-PR14-Q00, LXK2-PR14-R00 LXK2-PD12-Q00, LXK2-PD12-R00, LXK2-PD12-S00 LXK2-PH12-R00, LXK2-PH12-S00 LXK2-PL12-P00, LXK2-PL12-Q00, LXK2-PL12-R00 Source: www.luxeon.com KINGBRIGHT: KA-3528ASYC Source: www.kingbright.com
PAD1-PAD4 = wirepad:1,6/0,9: THROUGH-HOLE PAD
Q1 = transistor-fet:BSL207SP: OptiMOS(R)-P Small-Signal-Transistor P-Channel, Enhancement mode, Super Logic Level (2.5 V rated) Source: http://www.infineon.com/upload/Document/BSL207SP_Rev2.01.pdf
Q2 = microbuilder:CRYSTAL: Crystals HC49UP - Surface Mount Crystal 4.0MHz 18pF +/-30ppm Surface Mount Crystal [Digikey: 535-9857-1-ND] 12.0 MHz Surface Mount Crystal [Digikey: 535-9869-6-ND] 25.0 MHz Surface Mount Crystal [Digikey: 535-9078-1-ND] 3.2 x 2.5mm - MEMs SMT Crystal 12.0 MHz 8pF 15ppm 3.2 x 2.5mm Crystal [Digikey: -10-70°C: 644-1047-1-ND -40-125°C: 644-1128-1-ND] 16.0 MHz 8pF 15ppm 3.2 x 2.5mm Crystal [Digikey: -10-70°C: 644-1049-1-ND -40-125°C: 644-1129-2-ND] 16.0 MHz 10pF 10ppm 3.2 x 2.5mm Crystal [Digikey: 644-1100-1-ND] 27.12 MHz 18pF 30ppm 3.2 x 2.5mm Crystal [Digikey: 887-1424-1-ND] 27.12MHz 10pF 10ppm 3.2 x 2.5mm Crystal [Digikey: 887-1329-1-ND] 4.9 x 1.8mm - MEMs SMT Crystal 32.768 KHz 12.5pF 20ppm 4.9 x 1.8mm Crystal [Digikey: SE2415CT-ND] Cylinder 32.768KHz Cylinder Crystal
R1-R3 R7-R15 R17 R18 R53 R77 = resistor:R-US_: RESISTOR, American symbol
R4-R6 R16 R21-R24 R28 R29 R31 = adafruit:R-US_: RESISTOR, American symbol
R19 R20 R25-R27 R30 R32-R52 R54 R55 = resistor:R-EU_: RESISTOR, European symbol
R56 = varistor:VARISTOR: VARISTOR
RN2 = resistor-dil:4R-N: Array Chip Resistor Source: RS Component / Phycomp; OC_FARNELL: unknown; OC_NEWARK: unknown
S1 S2 = SparkFun:TAC_SWITCH: Momentary Switch Button commonly used for reset or general input. Spark Fun Electronics SKU : COM-00097
SJ1 SJ26 = SparkFun:SOLDERJUMPER_2WAY: Solder Jumper 2 way solder jumper
SJ2-SJ7 SJ27 = SparkFun-Retired:SOLDERJUMPER: Solder Jumper Standard SMD solder jumper. Used to automate production. Two varients : Normally Open and Normally Closed are the same, but have different paste layers. NC will have a large amount of paste and should jumper during reflow.
SJ8-SJ25 = jumper:SJ: SMD solder JUMPER
SW1 SW3 = dp_devices:SW_TACT_4P_B
T1 = transistor:*-NPN-: NPN Transistror BF959 corrected 2008.03.06
U1 = SparkFun-PowerIC:V_REG_LM1117: Voltage Regulator LM1117 Standard adjustable voltage regulator but in SMD form. Spark Fun Electronics SKU : COM-00595; PROD_ID: VREG-08170
U3 = SparkFun-Connectors_PETERMICROSDEBAY:USD-SOCKET: microSD Socket Push-push type uSD socket. Schematic element and footprint production proven. Spark Fun Electronics SKU : PRT-00127. tDoc lines correctly indicate media card edge positions when inserting (unlocked, locked, depressed).
U$1 U$5-U$9 = RepRapjr:POLOLU_A4983CARRIER
U$2 = ESP8266-ESP12:ESP8266_ESP-12: ESP8266 ESP-12 Discussion about pins here: http://www.esp8266.com/viewtopic.php?f=13&t=1429
U$10 U$13-U$16 = Cohesion_parts:N-POWER-MOSFET
U$11 U$12 U$17-U$20 = adafruit:FIDUCIAL: For use by pick and place machines to calibrate the vision/machine, 1mm By microbuilder.eu
X1 = con-phoenix-508:MSTBA2: PHOENIX; MF: FARNELL; MPN: 1757242; OC_FARNELL: 3705171; OC_NEWARK: 71C4161
X2 = con-phoenix-762:GMSTBA2: PHOENIX; MF: FARNELL; MPN: 1757242; OC_FARNELL: 3705171; OC_NEWARK: 71C4161
X3 = con-phoenix-762:GMSTBA4: PHOENIX; MF: FARNELL; MPN: 1757268; OC_FARNELL: 3705195; OC_NEWARK: 71C4163
X4-X7 = con-phoenix-350:1751248: MKDS 1/ 2-3,5 Printklemme Nennstrom: 10 A Bemessungsspannung: 160 V Raster: 3,5 mm Polzahl: 2 Montageart: Löten Anschlussart: Schraubanschluss Anschlussrichtung vom Leiter zur Platine: 0° Source: http://eshop.phoenixcontact.com .. 1751248.pdf; OC_FARNELL: unknown; OC_NEWARK: unknown
X14 = SparkFun:USB: USB Connectors USB-B-PTH is fully proven SKU : PRT-00139 USB-miniB is fully proven SKU : PRT-00587 USB-A-PCB is untested. USB-A-H is throughly reviewed, but untested. Spark Fun Electronics SKU : PRT-00437 USB-B-SMT is throughly reviewed, but untested. Needs silkscreen touching up. USB-A-S has not been used/tested USB-MB-H has not been used/tested

## Net classes
1 power: width 0.6 mm, clearance 0.305 mm
2 ground: width 0.254 mm
4 30-Amp Class: width 2.54 mm
5 3.3-Amp Class: width 1.27 mm